# EAGLE board vdac (EAGLE 8.1.1)
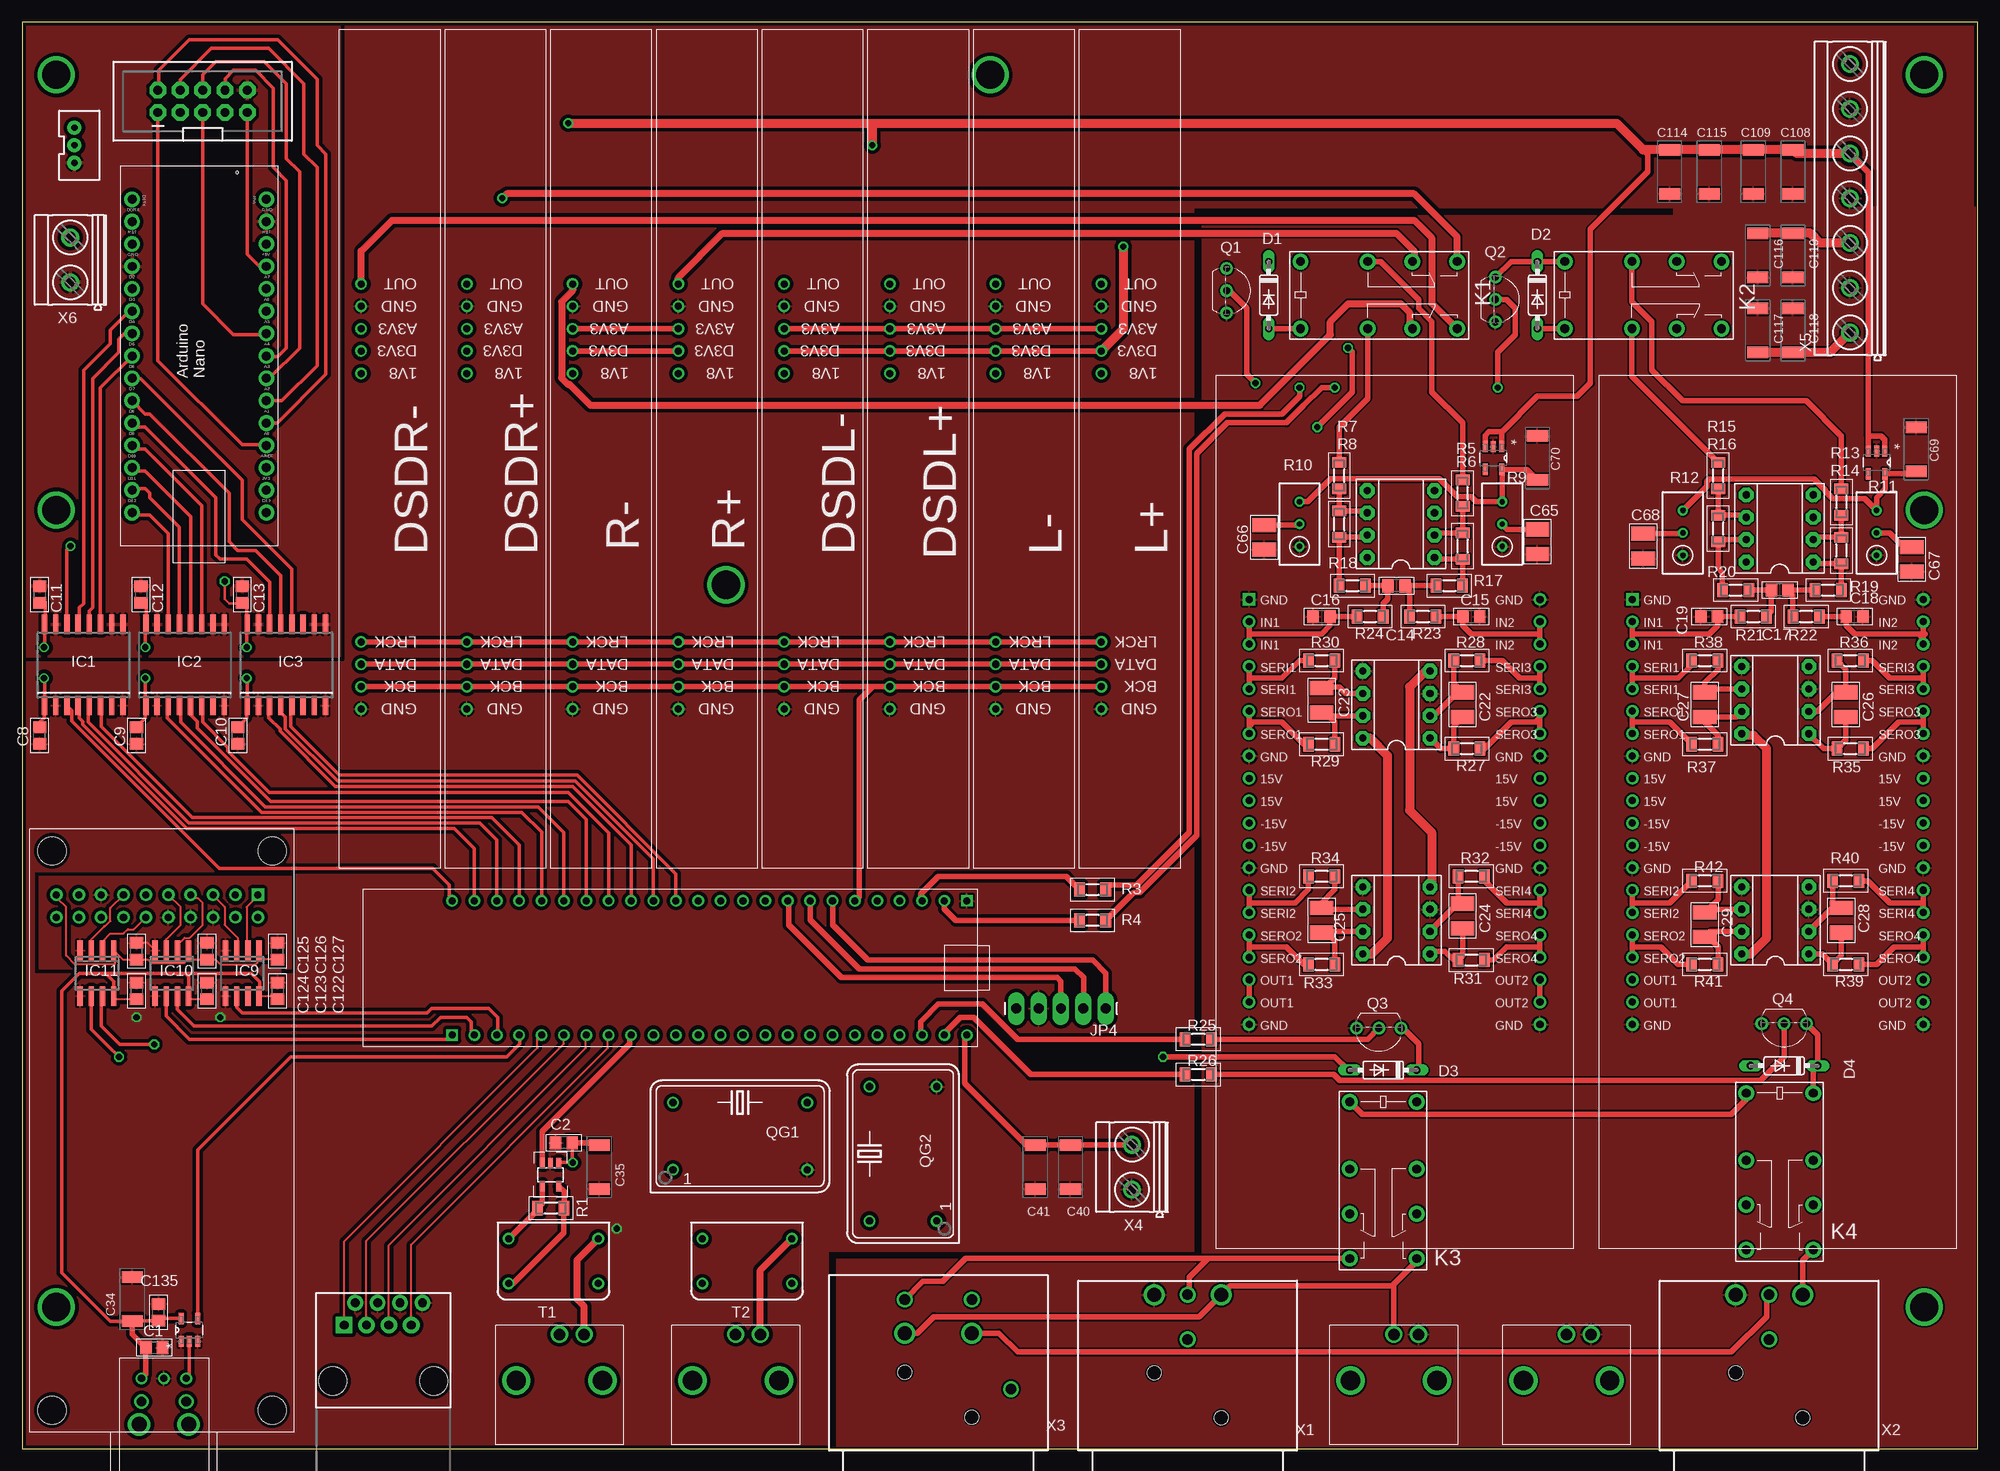
[diagram p6: board, top side]
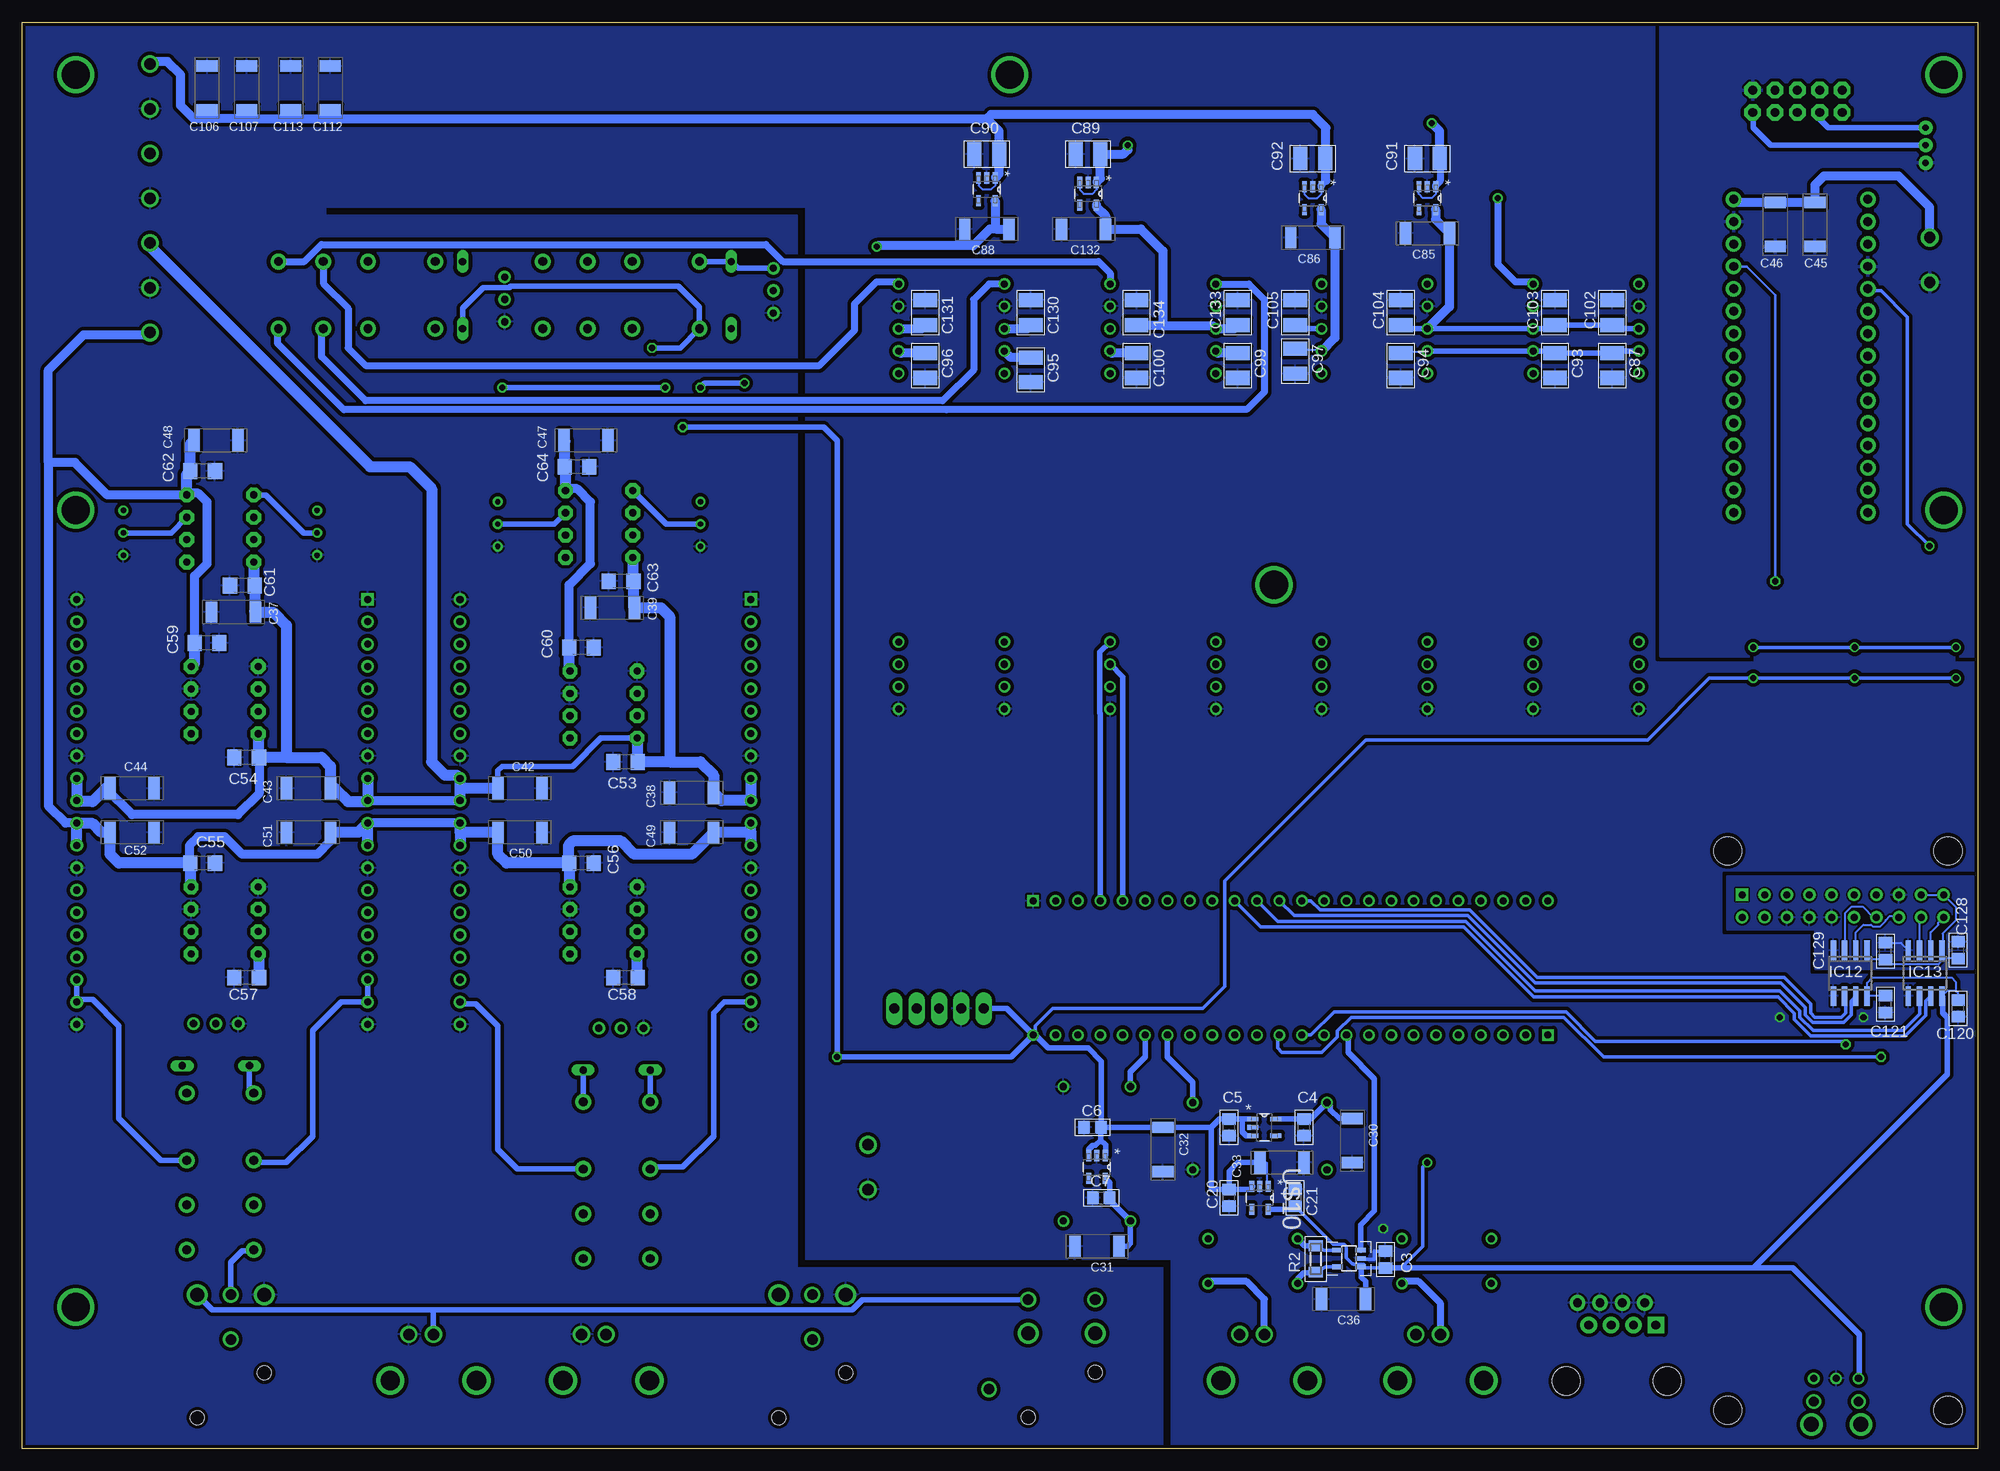
[diagram p7: board, bottom side, seen from below]

Size 222 x 162 mm. Coordinates in mm from the lower left corner, seen from the top.
Outline: 222,162 0,162 0,0 222,0 222,162
Copper layers (1*16): Top 0.035mm / dielectric 1.5mm / Bottom 0.035mm
Design rules "default *": minimum track width 10mil, minimum drill 24mil, track to track 8mil, track to pad 8mil, pad to pad 8mil, via to via 8mil, smd to smd 8mil, copper to edge 8mil, drill to drill 8mil, minimum pad ring 10mil, minimum via ring 8mil, stop-mask expansion 4mil, vias tented up to drill 0mil, thermal gap 10mil

## Footprints (pad centres in the part's own frame; a part is rotated, then mirrored left to right if it is on the bottom)
RCA = drill 1.3: 1_+ 0,0; 2_G -2.8,0 | drill 2.2: 3_NC -4.9,5.25; 4_NC 4.9,5.25
C0805 = smd 1.3 x 1.5: 1 -0.95,0; 2 0.95,0
C1210 = smd 1.6 x 2.7: 1 -1.4,0; 2 1.4,0
SP-CAP-CX = smd 1.3 x 2.4: + -2.5,0; - 2.5,0
C1206 = smd 1.6 x 1.8: 1 -1.4,0; 2 1.4,0
DO35-7 = drill 0.813 long: A 3.81,0; C -3.81,0
R2R = drill 0.8: 1 9.5,0; 2 12.04,0; 3 14.58,0; 4 17.12,0; 5 47.6,0; 6 50.14,0; 7 52.68,0; 8 55.22,0; 9 57.76,0
SO-16DW = smd 0.6 x 2.2: 1 -4.445,-4.6; 2 -3.175,-4.6; 3 -1.905,-4.6; 4 -0.635,-4.6; 5 0.635,-4.6; 6 1.905,-4.6; 7 3.175,-4.6; 8 4.445,-4.6; 9 4.445,4.6; 10 3.175,4.6; 11 1.905,4.6; 12 0.635,4.6; 13 -0.635,4.6; 14 -1.905,4.6; 15 -3.175,4.6; 16 -4.445,4.6
SO-08 = smd 0.6 x 2.2: 1 -1.905,-2.6; 2 -0.635,-2.6; 3 0.635,-2.6; 4 1.905,-2.6; 5 1.905,2.6; 6 0.635,2.6; 7 -0.635,2.6; 8 -1.905,2.6
RJ45-8 = drill 1 pad 1.88 square: 1 -4.445,6.35 | drill 1 pad 1.778: 2 -3.175,8.89; 4 -0.635,8.89; 6 1.905,8.89; 8 4.445,8.89 | drill 1 pad 1.88: 3 -1.905,6.35; 5 0.635,6.35; 7 3.175,6.35 | hole 3.2: -5.715,0; 5.715,0
2X5-SHROUDED = drill 1.016 pad 1.88 octagon: 1 -1.27,5.08; 2 1.27,5.08; 3 -1.27,2.54; 4 1.27,2.54; 5 -1.27,0; 6 1.27,0; 7 -1.27,-2.54; 8 1.27,-2.54; 9 -1.27,-5.08; 10 1.27,-5.08
JST-3-PTH-VERT = drill 0.7 pad 1.6: 1 -2,-0.55; 2 0,-0.55; 3 2,-0.55
1X05_LONGPADS = drill 1.118 pad 1.88 long: 1 0,0; 2 2.54,0; 3 5.08,0; 4 7.62,0; 5 10.16,0
G5V-2 = drill 1 pad 1.8: 1 -8.89,-3.81; 4 -1.27,-3.81; 6 3.81,-3.81; 8 8.89,-3.81; 9 8.89,3.81; 11 3.81,3.81; 13 -1.27,3.81; 16 -8.89,3.81
ARDUINO_NANO = drill 1.016 pad 1.778: 3V3 6.35,1.27; 5V 31.75,1.27; A0 11.43,1.27; A1 13.97,1.27; A2 16.51,1.27; A3 19.05,1.27; A4 21.59,1.27; A5 24.13,1.27; A6 26.67,1.27; A7 29.21,1.27; D2 29.21,16.51; D3 26.67,16.51; D4 24.13,16.51; D5 21.59,16.51; D6 19.05,16.51; D7 16.51,16.51; D8 13.97,16.51; D9 11.43,16.51; D10 8.89,16.51; D11 6.35,16.51; D12 3.81,16.51; D13 3.81,1.27; GND 31.75,16.51; GND. 36.83,1.27; REF 8.89,1.27; RST 34.29,16.51; RST. 34.29,1.27; RX1 36.83,16.51; TX1 39.37,16.51; VIN 39.37,1.27
TO92-EBC = drill 0.813 pad 1.422: B 0,-1.27; C -2.54,-1.27; E 2.54,-1.27
DIL14S = drill 0.813: 1 -7.62,-3.81; 7 7.62,-3.81; 8 7.62,3.81; 14 -7.62,3.81
MINI_MELF-0204W = smd 1.2 x 1.6: 1 -1.5,0; 2 1.5,0
RTRIM3296W = drill 0.61: 1 0,-2.54; 2 0,0; 3 0,2.54
DAC101 = drill 0.8 pad 1.27: 1 -5.08,2.54; 3 -5.08,-2.54; 4 5.08,-2.54; 6 5.08,2.54
SOT95P280X145-5N = smd 1.27 x 0.559: 1 -1.295,0.94; 2 -1.295,0; 3 -1.295,-0.94; 4 1.295,-0.94; 5 1.295,0.94
COMBO384 = drill 0.8 pad 1.422 square: 1_CABLE_PLUGGED 23.36,61 | drill 0.8 pad 1.422: 2_SDA 20.82,61; 3_DATA/DSD1 18.28,61; 4_CLD/DSDCLK 15.74,61; 5_FSCLK/DSD2 13.2,61; 6_MCLK 10.66,61; 7_DSDON 8.12,61; 8_GND 5.58,61; 9_3.3V 3.04,61; 10_3.3V 0.5,61; 11_MUTE 23.36,58.46; 12_SDA 20.82,58.46; 13_GND 18.28,58.46; 14_GND 15.74,58.46; 15_GND 13.2,58.46; 16_DSD64_128 10.66,58.46; 17_F0 8.12,58.46; 18_F1 5.58,58.46; 19_F2 3.04,58.46; 20_F3 0.5,58.46 | hole 3.2: 25,2.5; 0,2.5; 25,66; 0,66
TORX147 = drill 0.8: 1_VOUT -2.54,0; 2_GND 0,0; 3_VCC 2.54,0 | drill 1.1: 4_NC -2.54,2.625; 5_NC 2.54,2.625 | drill 1.7: P$1 -2.8,5.235; P$2 2.8,5.235
SOT23-5L = smd 0.55 x 1.2: 1 -0.95,-1.3; 2 0,-1.3; 3 0.95,-1.3; 4 0.95,1.3; 5 -0.95,1.3
DIL08 = drill 0.813 pad 1.676 octagon: 1 -3.81,-3.81; 2 -1.27,-3.81; 3 1.27,-3.81; 4 3.81,-3.81; 5 3.81,3.81; 6 1.27,3.81; 7 -1.27,3.81; 8 -3.81,3.81
SOT-23-5 = smd 1.27 x 0.559: 1 -1.295,0.94; 2 -1.295,0; 3 -1.295,-0.94; 4 1.295,-0.94; 5 1.295,0.94
VDACA = drill 0.8 pad 1.422 square: P$1 1.27,-19.05 | drill 0.8 pad 1.422: P$2 1.27,-21.59; P$3 1.27,-24.13; P$4 1.27,-26.67; P$5 1.27,-29.21; P$6 1.27,-31.75; P$7 1.27,-34.29; P$8 1.27,-36.83; P$9 1.27,-39.37; P$10 1.27,-41.91; P$11 1.27,-44.45; P$12 1.27,-46.99; P$13 1.27,-49.53; P$14 1.27,-52.07; P$15 1.27,-54.61; P$16 1.27,-57.15; P$17 1.27,-59.69; P$18 1.27,-62.23; P$19 1.27,-64.77; P$20 1.27,-67.31; P$21 34.29,-67.31; P$22 34.29,-64.77; P$23 34.29,-62.23; P$24 34.29,-59.69; P$25 34.29,-57.15; P$26 34.29,-54.61; P$27 34.29,-52.07; P$28 34.29,-49.53; P$29 34.29,-46.99; P$30 34.29,-44.45; P$31 34.29,-41.91; P$32 34.29,-39.37; P$33 34.29,-36.83; P$34 34.29,-34.29; P$35 34.29,-31.75; P$36 34.29,-29.21; P$37 34.29,-26.67; P$38 34.29,-24.13; P$39 34.29,-21.59; P$40 34.29,-19.05
CMODA7 = drill 0.8 square: P$1 59.69,16.51; P$25 1.27,1.27 | drill 0.8: P$2 57.15,16.51; P$3 54.61,16.51; P$4 52.07,16.51; P$5 49.53,16.51; P$6 46.99,16.51; P$7 44.45,16.51; P$8 41.91,16.51; P$9 39.37,16.51; P$10 36.83,16.51; P$11 34.29,16.51; P$12 31.75,16.51; P$13 29.21,16.51; P$14 26.67,16.51; P$15 24.13,16.51; P$16 21.59,16.51; P$17 19.05,16.51; P$18 16.51,16.51; P$19 13.97,16.51; P$20 11.43,16.51; P$21 8.89,16.51; P$22 6.35,16.51; P$23 3.81,16.51; P$24 1.27,16.51; P$26 3.81,1.27; P$27 6.35,1.27; P$28 8.89,1.27; P$29 11.43,1.27; P$30 13.97,1.27; P$31 16.51,1.27; P$32 19.05,1.27; P$33 21.59,1.27; P$34 24.13,1.27; P$35 26.67,1.27; P$36 29.21,1.27; P$37 31.75,1.27; P$38 34.29,1.27; P$39 36.83,1.27; P$40 39.37,1.27; P$41 41.91,1.27; P$42 44.45,1.27; P$43 46.99,1.27; P$44 49.53,1.27; P$45 52.07,1.27; P$46 54.61,1.27; P$47 57.15,1.27; P$48 59.69,1.27
NC3MBH = drill 1.6: 1 3.81,0; 2 -3.81,0 | drill 1.2: 3 0,0; G 0,5.08 | hole 1.6: -3.81,13.97; 3.81,8.89
NC4FBH = drill 1.2: 1 -3.81,0.55; 4 3.81,0.55; G -8.25,10.72 | drill 1.6: 2 -3.81,4.365; 3 3.81,4.365 | hole 1.6: -3.81,13.89; 3.81,8.81
MKDSN1,5/2-5,08 = drill 1.3 pad 2: 1 -2.561,0.025; 2 2.519,0.025
MKDSN1,5/7-5,08 = drill 1.3 pad 2: 1 -15.261,0.025; 2 -10.181,0.025; 3 -5.101,0.025; 4 -0.021,0.025; 5 5.059,0.025; 6 10.139,0.025; 7 15.219,0.025

## Placement (x,y rotation side)
BNC  RCA  [RCA]  81,13 180 top
C1  [C0805]  15,11.5 0 top
C2  [C0805]  61.5,34.75 180 top
C3  [C0805]  67.25,21.5 90 bottom
C4  [C0805]  76.5,36.5 90 bottom
C5  [C0805]  85,36.5 90 bottom
C6  [C0805]  100.5,36.5 0 bottom
C7  [C0805]  99.5,28.5 0 bottom
C8  [C0805]  2,81 90 top
C9  [C0805]  13,81 90 top
C10  [C0805]  24.5,81 90 top
C11  [C0805]  2,97 270 top
C12  [C0805]  13.5,97 270 top
C13  [C0805]  25,97 270 top
C14  [C0805]  156,98 180 top
C15  [C0805]  164.5,94.5 0 top
C16  [C0805]  147.5,94.5 0 top
C17  [C0805]  199.5,97.5 180 top
C18  [C0805]  208,94.5 0 top
C19  [C0805]  191.5,94.5 0 top
C20  [C0805]  85,28.5 90 bottom
C21  [C0805]  77.5,28.5 270 bottom
C22  [C1210]  163.5,84.5 270 top
C23  [C1210]  147.5,85 270 top
C24  [C1210]  163.5,60.5 270 top
C25  [C1210]  147.5,60 270 top
C26  [C1210]  207,84.5 270 top
C27  [C1210]  191,84.5 270 top
C28  [C1210]  206.5,60 270 top
C29  [C1210]  191,59.5 270 top
C30  [SP-CAP-CX]  71,35 270 bottom
C31  [SP-CAP-CX]  100,23 180 bottom
C32  [SP-CAP-CX]  92.5,34 270 bottom
C33  [SP-CAP-CX]  79,32.5 0 bottom
C34  [SP-CAP-CX]  12.5,17 90 top
C35  [SP-CAP-CX]  65.5,32 270 top
C36  [SP-CAP-CX]  72,17 180 bottom
C37  [SP-CAP-CX]  198,95 180 bottom
C38  [SP-CAP-CX]  146,74.5 180 bottom
C39  [SP-CAP-CX]  155,95.5 180 bottom
C40  [SP-CAP-CX]  119,32 270 top
C41  [SP-CAP-CX]  115,32 270 top
C42  [SP-CAP-CX]  165.5,75 0 bottom
C43  [SP-CAP-CX]  189.5,75 180 bottom
C44  [SP-CAP-CX]  209.5,75 0 bottom
C45  [SP-CAP-CX]  18.5,139 270 bottom
C46  [SP-CAP-CX]  23,139 270 bottom
C47  [SP-CAP-CX]  158,114.5 180 bottom
C48  [SP-CAP-CX]  200,114.5 180 bottom
C49  [SP-CAP-CX]  146,70 0 bottom
C50  [SP-CAP-CX]  165.5,70 180 bottom
C51  [SP-CAP-CX]  189.5,70 0 bottom
C52  [SP-CAP-CX]  209.5,70 180 bottom
C53  [C1206]  153.5,78 180 bottom
C54  [C1206]  196.5,78.5 180 bottom
C55  [C1206]  201.5,66.5 180 bottom
C56  [C1206]  158.5,66.5 180 bottom
C57  [C1206]  196.5,53.5 180 bottom
C58  [C1206]  153.5,53.5 180 bottom
C59  [C1206]  201,91.5 180 bottom
C60  [C1206]  158.5,91 180 bottom
C61  [C1206]  197,98 180 bottom
C62  [C1206]  201.5,111 180 bottom
C63  [C1206]  154,98.5 180 bottom
C64  [C1206]  159,111.5 180 bottom
C65  [C1210]  172,103 270 top
C66  [C1210]  141,103.5 270 top
C67  [C1210]  214.5,101 270 top
C68  [C1210]  184,102.5 270 top
C69  [SP-CAP-CX]  215,113.5 90 top
C70  [SP-CAP-CX]  172,112.5 90 top
C85  [SP-CAP-CX]  62.5,138 180 bottom
C86  [SP-CAP-CX]  75.5,137.5 180 bottom
C87  [C1210]  41.5,123 270 bottom
C88  [SP-CAP-CX]  112.5,138.5 180 bottom
C89  [C1210]  101,147 180 bottom
C90  [C1210]  112.5,147 180 bottom
C91  [C1210]  62.5,146.5 180 bottom
C92  [C1210]  75.5,146.5 180 bottom
C93  [C1210]  48,123 270 bottom
C94  [C1210]  65.5,123 270 bottom
C95  [C1210]  107.5,122.5 270 bottom
C96  [C1210]  119.5,123 270 bottom
C97  [C1210]  77.5,123.5 270 bottom
C99  [C1210]  84,123 270 bottom
C100  [C1210]  95.5,123 270 bottom
C102  [C1210]  41.5,129 90 bottom
C103  [C1210]  48,129 90 bottom
C104  [C1210]  65.5,129 90 bottom
C105  [C1210]  77.5,129 90 bottom
C106  [SP-CAP-CX]  201,154.5 90 bottom
C107  [SP-CAP-CX]  196.5,154.5 90 bottom
C108  [SP-CAP-CX]  201,145 270 top
C109  [SP-CAP-CX]  196.5,145 270 top
C112  [SP-CAP-CX]  187,154.5 90 bottom
C113  [SP-CAP-CX]  191.5,154.5 90 bottom
C114  [SP-CAP-CX]  187,145 270 top
C115  [SP-CAP-CX]  191.5,145 270 top
C116  [SP-CAP-CX]  197,135.5 270 top
C117  [SP-CAP-CX]  197,127 270 top
C118  [SP-CAP-CX]  201,127 270 top
C119  [SP-CAP-CX]  201,135.5 270 top
C120  [C0805]  2.25,50 90 bottom
C121  [C0805]  10.5,50.5 90 bottom
C122  [C0805]  29,52 270 top
C123  [C0805]  21,52 270 top
C124  [C0805]  13,52 270 top
C125  [C0805]  13,56.5 90 top
C126  [C0805]  21,56.5 90 top
C127  [C0805]  29,56.5 90 top
C128  [C0805]  2.25,56.62 90 bottom
C129  [C0805]  10.5,56.5 90 bottom
C130  [C1210]  107.5,129 90 bottom
C131  [C1210]  119.5,129 90 bottom
C132  [SP-CAP-CX]  101.5,138.5 180 bottom
C133  [C1210]  84,129 90 bottom
C134  [C1210]  95.5,129 90 bottom
C135  [C0805]  15.5,15.5 90 top
COAX  RCA  [RCA]  61,13 180 top
D1  1N4148DO35-7  [DO35-7]  141.5,131 270 top
D2  1N4148DO35-7  [DO35-7]  172,131 270 top
D3  1N4148DO35-7  [DO35-7]  154.5,43 180 top
D4  1N4148DO35-7  [DO35-7]  200,43.5 180 top
DSDL+  R2R  [R2R]  98.5,74.5 90 top
DSDL-  R2R  [R2R]  86.5,74.5 90 top
DSDR+  R2R  [R2R]  50.5,74.5 90 top
DSDR-  R2R  [R2R]  38.5,74.5 90 top
IC1  ISO7240  [SO-16DW]  7,89 0 top
IC2  ISO7240  [SO-16DW]  18.5,89 0 top
IC3  ISO7240  [SO-16DW]  30,89 0 top
IC9  ISO7220A  [SO-08]  25,54 180 top
IC10  ISO7220A  [SO-08]  17,54 180 top
IC11  ISO7220A  [SO-08]  8.5,54 180 top
IC12  ISO7220A  [SO-08]  14.5,54 180 bottom
IC13  ISO7220A  [SO-08]  6,54 180 bottom
JP1  RJ45  [RJ45-8]  41,7.7 0 top
JP2  [2X5-SHROUDED]  20.5,153 90 top
JP3  [JST-3-PTH-VERT]  6.5,148 270 top
JP4  [1X05_LONGPADS]  123,50 180 top
K1  G5V-2  [G5V-2]  154,131 0 top
K2  G5V-2  [G5V-2]  184,131 0 top
K3  G5V-2  [G5V-2]  154.5,30.5 270 top
K4  G5V-2  [G5V-2]  199.5,31.5 270 top
L+  R2R  [R2R]  122.5,74.5 90 top
L-  R2R  [R2R]  110.5,74.5 90 top
PCB1  ARDUINO_NANO  [ARDUINO_NANO]  29,102.5 90 top
Q1  BC550C  [TO92-EBC]  138,131.5 270 top
Q2  BC550C  [TO92-EBC]  168.5,130.5 270 top
Q3  BC550C  [TO92-EBC]  154,46.5 180 top
Q4  BC550C  [TO92-EBC]  200,47 180 top
QG1  [DIL14S]  81.5,35.5 0 top
QG2  [DIL14S]  100,33.5 90 top
R1  [MINI_MELF-0204W]  60.03,27.34 0 top
R2  [MINI_MELF-0204W]  75.16,21.55 270 bottom
R3  [MINI_MELF-0204W]  121.5,63.5 0 top
R4  [MINI_MELF-0204W]  121.5,60 0 top
R5  [MINI_MELF-0204W]  163.5,108.5 270 top
R6  [MINI_MELF-0204W]  163.5,102.5 270 top
R7  [MINI_MELF-0204W]  149.5,110.5 270 top
R8  [MINI_MELF-0204W]  149.5,105 270 top
R9  [RTRIM3296W]  168,105 0 top
R10  [RTRIM3296W]  145,105 0 top
R11  [RTRIM3296W]  210.5,104 0 top
R12  [RTRIM3296W]  188.5,104 0 top
R13  [MINI_MELF-0204W]  206.5,107.5 270 top
R14  [MINI_MELF-0204W]  206.5,102 270 top
R15  [MINI_MELF-0204W]  192.5,110.5 270 top
R16  [MINI_MELF-0204W]  192.5,104.5 270 top
R17  [MINI_MELF-0204W]  162,98 180 top
R18  [MINI_MELF-0204W]  151,98 0 top
R19  [MINI_MELF-0204W]  205,97.5 180 top
R20  [MINI_MELF-0204W]  194.5,97.5 0 top
R21  [MINI_MELF-0204W]  196.5,94.5 180 top
R22  [MINI_MELF-0204W]  202.5,94.5 0 top
R23  [MINI_MELF-0204W]  159,94.5 0 top
R24  [MINI_MELF-0204W]  153,94.5 180 top
R25  [MINI_MELF-0204W]  133.5,46.5 0 top
R26  [MINI_MELF-0204W]  133.5,42.5 0 top
R27  [MINI_MELF-0204W]  164,79.5 0 top
R28  [MINI_MELF-0204W]  164,89.5 180 top
R29  [MINI_MELF-0204W]  147.5,80 180 top
R30  [MINI_MELF-0204W]  147.5,89.5 0 top
R31  [MINI_MELF-0204W]  164.5,55.5 0 top
R32  [MINI_MELF-0204W]  164.5,65 180 top
R33  [MINI_MELF-0204W]  147.5,55 180 top
R34  [MINI_MELF-0204W]  147.5,65 0 top
R35  [MINI_MELF-0204W]  207.5,79.5 0 top
R36  [MINI_MELF-0204W]  207.5,89.5 180 top
R37  [MINI_MELF-0204W]  191,80 180 top
R38  [MINI_MELF-0204W]  191,89.5 0 top
R39  [MINI_MELF-0204W]  207,55 0 top
R40  [MINI_MELF-0204W]  207,64.5 180 top
R41  [MINI_MELF-0204W]  191,55 180 top
R42  [MINI_MELF-0204W]  191,64.5 0 top
R+  R2R  [R2R]  74.5,74.5 90 top
R-  R2R  [R2R]  62.5,74.5 90 top
RCAL  RCA  [RCA]  175.3,13 180 top
RCAR  RCA  [RCA]  155.7,13 180 top
T1  DAC101C  [DAC101]  60.32,21.31 180 top
T2  DAC101C  [DAC101]  82.29,21.31 180 top
U1  SN74LVC1G125DBVT  [SOT95P280X145-5N]  19,13.5 90 top
U$1  COMBO384  [COMBO384]  3.4,1.9 0 top
U$2  TORX147  [TORX147]  16.1,8 180 top
U$3  MAX3280E  [SOT23-5L]  59.98,31.12 180 top
U$4  MAX3280E  [SOT23-5L]  71.38,21.61 90 bottom
U$5  LME49720  [DIL08]  156.5,105 90 top
U$6  LME49720  [DIL08]  199.5,104.5 90 top
U$7  LP5907  [SOT-23-5]  167,112.5 270 top
U$8  LP5907  [SOT-23-5]  210.5,112 270 top
U$9  VDACA  [VDACA]  181.5,115.5 0 top
U$10  LP5907  [SOT-23-5]  81.5,28.5 270 bottom
U$11  VDACA  [VDACA]  138,115.5 0 top
U$12  CMOD-A7  [CMODA7]  108.5,63.5 180 top
U$13  LME49720  [DIL08]  156,84.5 90 top
U$14  LME49720  [DIL08]  156,60 90 top
U$15  LP5907  [SOT-23-5]  81,36.5 0 bottom
U$16  LP5907  [SOT-23-5]  100,32 270 bottom
U$17  LP5907  [SOT-23-5]  75.5,142 270 bottom
U$18  LP5907  [SOT-23-5]  62.5,142 270 bottom
U$19  LP5907  [SOT-23-5]  101,142.5 270 bottom
U$20  LP5907  [SOT-23-5]  112.5,143 270 bottom
U$21  LME49720  [DIL08]  199,85 90 top
U$22  LME49720  [DIL08]  199,60 90 top
X1  NC3MBH  [NC3MBH]  132.3,17.5 180 top
X2  NC3MBH  [NC3MBH]  198.3,17.5 180 top
X3  NC4FBH  [NC4FBH]  104,17.5 180 top
X4  MKDSN1,5/2-5,08  [MKDSN1,5/2-5,08]  126,32 90 top
X5  MKDSN1,5/7-5,08  [MKDSN1,5/7-5,08]  207.5,142 90 top
X6  MKDSN1,5/2-5,08  [MKDSN1,5/2-5,08]  5.5,135 90 top

## Tracks (layer width: path | path; a pad name or v marks a point on that pad's centre or on a via)
22.5792
  Bottom 0.61: QG2.8 96.19,42.81 94.5,44.5 94.5,46.96 U$12.P$19
24.756
  Bottom 0.61: QG1.8 89.12,41.62 92,44.5 U$12.P$18
+15V
  Top 1.016: U$14.8 153.19,56.19 155,58 155,78.69 153,80.69 U$13.8 | U$22.8 196.19,56.19 198,58 198,79.5 196.5,81 195.38,81 U$21.8 | X5.3 204.1,136.9 203,138 C119.+ C116.+
  Bottom 0.61: U$13.8 156.31,80.69 159.5,77.5 167.5,77.5 168,77 C42.+
  Bottom 1.016: C54.1 195.1,74.4 197.5,72 209.5,72 212.5,75 | U$9.P$10 U$11.P$31
  Bottom 1.27: X5.3 207.47,136.47 182.5,111.5 178,111.5 175.5,109 175.5,78 174,76.5 172.66,76.5 U$11.P$32 172.29,75 | U$11.P$31 172.29,75 | C42.+ 172.29,75 | U$11.P$9 U$11.P$10 142.59,73.59 C38.+ 143.5,76.5 145,78 148.5,78 | 148.5,78 C53.1 152.1,80.6 U$13.8 | U$5.8 152.69,98.59 C63.1 152.6,95.6 C39.+ 149.5,95.5 148.5,94.5 148.5,78 | U$6.8 195.69,98.09 C61.1 195.6,95.1 C37.+ 193.5,95 192,93.5 192,78.5 | U$21.8 195.19,78.59 C54.1 192,78.5 | C44.+ 212.5,75 214,73.5 215.7,73.5 U$9.P$31 U$9.P$32 | U$9.P$9 U$9.P$10 182.86,73.5 185,73.5 186.5,75 C43.+ 187,77.5 188,78.5 192,78.5 | C57.1 195.1,56.1 U$22.8 | U$14.8 152.19,53.59 C58.1
-15V
  Top 1.016: C117.- C118.- 205.24,124.5 X5.1 | U$13.4 159.31,88.31 157.5,86.5 157.5,72.5 160,70 160,64 U$14.4
  Bottom 1.016: U$11.P$30 U$9.P$11 | C51.- 187,69 188.5,67.5 197,67.5 199,69.5 202,69.5 203,68.5 203,66.6 C55.2 | U$9.P$30 217.05,71.05 219,73 219,112 | 219,112 219,122.5 215,126.5 207.71,126.5 X5.1 | 219,112 216,112 212.31,108.31 U$6.4 203.12,108.5 202,108.5 201,107.5 201,100.5 202.4,99.1 C59.2 | C60.2 159.9,98.1 157.5,100.5 157.5,107.5 159,109 160.12,109 U$5.4
  Bottom 1.27: U$5.4 160.31,111.41 C64.2 160.4,114.4 C47.- | U$6.4 203.31,110.59 C62.2 202.9,114.1 C48.- | C59.2 202.4,89.22 U$21.4 | U$22.4 202.9,63.9 C55.2 211,66.5 212,67.5 C52.- 213,70 214,71 215.74,71 U$9.P$30 U$9.P$29 | C51.- 183.82,70 U$9.P$11 U$9.P$12 | 172.29,70 U$11.P$30 | 172.29,70 U$11.P$29 | 172.29,70 C50.- 168,67.5 167,66.5 C56.2 | 139.27,70 U$11.P$11 | 139.27,70 U$11.P$12 | 139.27,70 C49.- 146,67.5 152.5,67.5 154,69 159.5,69 160,68.5 160,66.6 C56.2 | C56.2 159.9,63.9 U$14.4 | C60.2 159.9,88.4 U$13.4
A
  Top 0.406: JP2.1 15.42,123.58 25,114 27.66,114 PCB1.A0
B
  Top 0.406: PCB1.A1 28.97,116.47 34.5,122 34.5,147 33.5,148 33.5,155.5 29,160 19,160 15.5,156.5 15.5,154.35 JP2.2
BCK
  Top 0.61: DSDR-.2 DSDR+.2 R-.2 R+.2 DSDL-.2 DSDL+.2 | DSDL+.2 L-.2 L+.2 | DSDL+.2 96.54,86.54 95,85 95,62.7 U$12.P$30
BCKI
  Top 0.61: JP4.3 117.92,53.08 117.5,53.5 93,53.5 87,59.5 87,62.14 U$12.P$33
BNCIN
  Bottom 0.61: U$4.3 70.08,25.42 68.5,27 68.5,42 71.5,45 71.5,46.82 U$12.P$10
COAXIN
  Top 0.61: U$3.3 59.03,36.03 69,46 69,46.86 U$12.P$9
D2  (via drill 0.7)
  Top 0.406: IC1.14 5.09,102.09 v5.5,102.5
  Bottom 0.406: v5.5,102.5 8,105 8,128.5 11,131.5 12.28,131.5 PCB1.D2
D3
  Top 0.406: PCB1.D3 12.17,129.17 10,127 10,125.5 7,122.5 7,96 6.5,95.5 6.5,93.73 IC1.13
D4
  Top 0.406: IC1.12 7.63,95.14 8,95.5 8,121.5 11,124.5 11,126 12,127 12.12,127 PCB1.D4
D5
  Top 0.406: IC1.11 8.9,120.5 PCB1.D5
DACA  (via drill 0.7)
  Top 0.61: 167.94,115.44 U$7.1 | 167.94,115.44 172,119.5 176.5,119.5 178,121 178,138.5 184.5,145 184.5,147 184,147.5 | 209.56,115 U$8.3 | 209.56,115 209.56,144.97 X5.5 | U$8.1 211.44,114.56 211,115 209.56,115 | U$7.3 166.06,115.06 166.5,115.5 167.88,115.5 167.94,115.44
  Top 1.016: v62,150.5 96.5,150.5 | 96.5,150.5 179.5,150.5 180,150.5 180.5,150.5 181,150.5 184,147.5 C114.+ C115.+ C109.+ C108.+ 201.44,147.06 X5.5 | 96.5,150.5 v96.5,148
  Bottom 0.254: 100.01,143.85 100.25,143.75 U$19.1 100,143.74 100,143 100.5,142.5 101.5,142.5 101.94,142.94 U$19.3 | U$18.1 61.56,142.44 62,142 63,142 63.5,142.5 63.5,143.24 U$18.3
  Bottom 0.813: U$18.1 61.56,143.44 61,144 61,146.4 C91.1
  Bottom 1.016: 100.01,143.85 99.6,144.26 C89.1 97,147 96.5,147.5 v96.5,148 | C91.1 61.1,149.6 v62,150.5
DACD
  Bottom 0.254: 111.51,144.35 111.75,144.25 U$20.1 111.5,144.24 111.5,143.5 112,143 113,143 113.44,143.44 U$20.3 | U$17.3 76.44,142.44 76,142 75,142 74.5,142.5 74.5,143.24 U$17.1
  Bottom 0.813: U$17.1 74.56,143.44 74,144 74,146.4 C92.1
  Bottom 1.016: 111.51,144.35 111.1,144.76 C90.1 111.1,149.6 112.5,151 | 187,151 112.5,151 | 191.5,151 187,151 | 196.5,151 191.5,151 | 196.5,151 201.26,151 | 74,144 74,150 75.5,151.5 112,151.5 112.5,151 | C112.+ 187,151 | C113.+ 191.5,151 | C107.+ 196.5,151 | C106.+ 201,151.26 201.26,151 | 201.26,151 202.5,151 204,152.5 204,156 205.5,157.5 207.19,157.5 X5.7
DATA
  Top 0.61: L+.3 L-.3 DSDL+.3 DSDL-.3 R+.3 R-.3 DSDR+.3 DSDR-.3
  Bottom 0.61: U$12.P$29 97.07,87.65 DSDL+.3
DATAI
  Top 0.61: U$12.P$32 89.45,60.05 95,54.5 119.5,54.5 120.5,53.5 120.5,50.04 JP4.2
DSD  (via drill 0.7)
  Top 0.406: v15,45.93 11.07,45.93 9,48 9,51.27 IC11.7
  Bottom 0.406: U$12.P$12 75.71,46.99 73.09,49.61 46.75,49.61 43.42,46.28 15.28,46.28 15,46 v15,45.93
F0
  Bottom 0.406: U$12.P$37 75.71,62.23 74.65,61.17 57.67,61.17 50,53.5 22,53.5 19,50.5 19,49.5 18.5,49 15.5,49 15,49.5 15,51.27 IC12.6
F1
  Bottom 0.406: IC12.7 14.39,50.88 14.39,49.25 15.25,48.39 18.75,48.39 19.61,49.25 19.61,50.11 22.39,52.89 50.25,52.89 57.92,60.56 77.62,60.56 U$12.P$36
F2
  Bottom 0.406: IC13.6 6.63,49.37 8.5,47.5 18.72,47.5 20.22,48.99 20.22,49.72 22.5,52 50.22,52 58.11,59.89 79.49,59.89 U$12.P$35
F3
  Bottom 0.406: IC13.7 5.93,50.84 5.93,49.21 8.25,46.89 18.98,46.89 20.83,48.74 20.83,49.47 22.68,51.32 50.41,51.32 58.37,59.28 81.42,59.28 U$12.P$34
FDSDON1
  Top 0.61: R3.1 118.5,65 104,65 102,63 102,62.38 U$12.P$27
FDSDON2
  Top 0.61: U$12.P$26 104.69,61.31 106,60 R4.1
FV  (via drill 0.7)
  Top 0.406: C8.2 2,82.5 2.5,83 2.5,84.34 IC1.1 2.56,86.94 2.5,87 v2.5,87.5 | C9.2 13,82 14,83 14,84.34 IC2.1 14,84.45 v14,87.5 | C10.2 24.5,82 25.5,83 25.5,84.34 IC3.1 25.55,87.44 v25.5,87.5
  Top 0.61: K2.1 D2.A | D1.A K1.1 | K4.1 195.69,39.69 194,38 158.91,38 158.89,37.98 152.1,37.98 K3.1 | D3.A 150.5,43 149,44.5 v129.5,44.5 | v147,116 151,120 151,124.5 v150.5,125 | X4.2 119.02,34.52 C40.+ C41.+ 114,34.5 107,41.5 107,46.76 U$12.P$24
  Bottom 0.254: C33.+ 80.75,32.5 80.75,30 U$10.1
  Bottom 0.406: v2.5,87.5 v14,87.5 v25.5,87.5 30.5,87.5 37.5,80.5 69.5,80.5 85.5,64.5 85.5,52.5 88,50 105,50 107,48 107,47.22 U$12.P$24 106.99,46.99
  Bottom 0.61: 106.99,46.99 105.5,45.5 101,45.5 99.5,44 99.5,36.55 C6.2 | 87,36.5 C32.+ C6.2 | 99.55,35.05 C6.2 | 99.55,35.05 99,34.5 99,33.36 U$16.1 | C20.2 82.44,29.45 U$10.3 82.3,29.8 | C20.2 87,29.45 87,36.5 | 99.55,35.05 100.16,34.44 100.49,34.44 100.94,33.99 U$16.3 | C33.+ 84,32.5 85,31.5 C20.2 | D2.A 172,129.5 169.68,131.82 166.72,131.82 166.55,132 147.5,132 145.11,129.61 K1.1 147.3,125 v150.5,125 | D3.A K3.1 | D4.A 196.19,40.89 K4.1 | 83.5,37.45 C5.2 86.05,37.45 87,36.5 | 83.5,37.45 U$15.1 | U$15.3 83.06,35.56 83.5,36 83.5,37.45 | v147,116 131,116 129.5,114.5 v129.5,44.5 109.72,44.5 U$12.P$24 110.24,50 JP4.5
GND  (via drill 0.7)
  Bottom 0.406: C3.2 68.45,22.45 68.5,22.5 68.5,21.5 69.41,21.5 69.45,21.54 69.63,21.54 69.8,21.59 69.92,21.54 70.01,21.54 U$4.2
  other vias: 13,49 22.5,49 67.5,25
  pour Bottom (isolate 0.406, rank 2): -0.5,-0.5 91.5,-0.5 91.5,21.5 133,21.5 133,141 222,141 222,162 -0.5,162
  pour Top (isolate 0.406, rank 2): -0.5,-0.5 91.5,-0.5 91.5,22.5 133,22.5 133,141 222,141 222,162 -0.5,162
  pour Top: 92.5,-1 92.5,21.5 134,21.5 134,140 187.5,140 187.5,141 222.5,141 222.5,-1
  pour Bottom (isolate 0.406): 92.5,-0.5 92.5,20.5 134,20.5 134,140 187.5,140 187.5,141 222.5,141 222.5,-0.5
I3V3  (via drill 0.7)
  Top 0.254: C124.2 10.76,51.05 IC11.8 | C122.2 28.65,51.4 IC9.8 27,51.49 | 4.5,52 4.5,22.5 | 9.5,54 18.5,54 26,54 | C123.2 19.25,51.05 IC10.8
  Top 0.406: 62,32.5 v62.5,32.5 | 62,32.5 61.01,32.5 U$3.1 | C2.1 62.45,32.95 62,32.5 | U1.5 15.5,14.79 C135.1 12.5,14.55 C34.+ 10,14.5 4.5,20 4.5,52 6.5,54 9.5,54 | 9.5,54 12.07,54 12.08,54.01 25.99,54.01 26,54 27,53 27,51.49 | IC10.8 18.91,53.59 18.5,54 | IC11.8 10.4,53.09 9.5,54
  Top 0.61: C2.1 65.25,34.75 C35.+ | U$2.3_VCC 14.05,8.49 C1.1 14,11.5 12.5,13 C34.+
  Bottom 0.254: C120.2 2.25,51.75 2.5,52 | 2.5,52 3.5,52 IC13.8 | C121.2 12.54,51.45 IC12.8 12.6,52.91 12,53.5 3,53.5 2.5,53 2.5,52
  Bottom 0.406: C21.2 73.19,23.24 71.91,23.24 71.67,23 71.67,21.67 71,21 70.92,21 70.85,20.93 70.35,20.93 U$4.1 69.97,20.55 C3.1 65.45,20.55 63,23 63,32 v62.5,32.5
  Bottom 0.61: U$10.5 77.5,27.2 C21.2 | 70.39,20.83 69.75,20.83 U$4.1 70,20.58 70,19.5 69.5,19 C36.+ | C3.1 25.45,20.55 | 25.45,20.55 3.5,42.5 3.5,48.18 3.51,48.19 3.51,49.01 4,49.5 4,51.3 IC13.8 | 25.45,20.55 21.05,20.55 13.5,13 13.5,8.06 U$2.3_VCC
K
  Top 0.406: JP2.4 17.96,155.46 21.5,159 28,159 32,155 32,147 33.5,145.5 33.5,123 29.5,119 PCB1.A2
L+
  Top 0.61: K2.13 182.73,130.27 185,128 185,122.5 188.5,119 202.5,119 206.5,115 R13.1
L+OUT
  Top 0.61: X2.2 202.11,21.41 K4.9
  Bottom 0.61: X3.1 126.62,16.95 127.78,15.79 175.5,15.79 | X2.2 200.4,15.79 175.5,15.79 | RCAL.1_+ 175.3,15.59 175.5,15.79
L-
  Top 0.61: K2.4 182.73,121.77 R15.1
L-OUT
  Top 0.61: X3.2 110.86,13.13 113,11 194,11 198,15 198,17.2 X2.3
  Bottom 0.61: K4.8 195.8,22.5 197,22.5 198.3,21.2 X2.3
LC
  Top 0.61: R26.1 114.5,42.5 108,49 106.5,49 104.69,47.19 U$12.P$23
LRCK
  Top 0.61: DSDR-.4 DSDR+.4 R-.4 R+.4 DSDL-.4 DSDL+.4 L-.4 L+.4
  Bottom 0.61: U$12.P$28 99.61,83.47 99.66,83.52 99.66,90.46 DSDL+.4
LRCKI
  Top 0.61: JP4.1 123,54 121.5,55.5 96,55.5 92,59.5 U$12.P$31
MCUGND
  pour Top (isolate 0.406): 0,162.5 36,162.5 36,90 0,90
  pour Bottom (isolate 0.406): 0,90 36,90 36,162 0,162
MCUV
  Bottom 1.016: X6.2 5.47,140.97 9,144.5 17.5,144.5 18.5,143.5 C45.+ C46.+ 27.36,141.5 PCB1.VIN
N$1
  Bottom 0.813: COAX.1_+ 61,16.5 63.5,19 65.17,19 T1.1
N$2
  Top 0.813: COAX.2_G 63.8,16.2 63,17 63,21.45 T1.3
N$3
  Bottom 0.813: BNC.1_+ 81,17 83,19 87.14,19 T2.1
N$4
  Top 0.813: BNC.2_G 83.8,20.28 T2.3
N$5
  Top 0.61: U$3.5 61.53,29.22 R1.2 61.5,27.31 61.5,24.5 55.77,18.77 T1.6
N$6
  Top 0.61: U$3.4 59.03,27.84 R1.1 58.53,27.14 T1.4
N$7
  Bottom 0.406: U$4.5 74.05,20.66 R2.2
  Bottom 0.61: T2.6 77.21,19.29 76.5,20 75.21,20 R2.2
N$8
  Bottom 0.406: U$4.4 74.17,22.56 R2.1
  Bottom 0.61: R2.1 76.41,23.05 T2.4
N$9  (via drill 3.2 pad 1.02)
  other vias: 79.9,98.1
N$10
  Top 0.813: R+.9 74.5,133 79.5,138 156,138 158,136 158,135 K1.11
N$11  (via drill 0.7)
  Top 0.813: K1.9 162.89,137.61 158,142.5 55,142.5 v54.5,142
  Bottom 0.813: v54.5,142 54.5,134.5 52.5,132.5 50.74,132.5 DSDR+.9
N$12
  Top 0.813: R-.9 62.5,131.51 61.24,130.24 61.24,121.58 61.98,120.84 62.16,120.84 64.5,118.5 140.5,118.5 148.5,126.5 148.5,128 150.5,130 156.5,130 157.5,129 157.5,127.5 K1.6 157.5,126.88
N$13
  Top 0.813: DSDR-.9 38.5,136 42,139.5 158,139.5 160,137.5 160,130.08 K1.8
N$14
  Bottom 0.813: K2.11 187.81,132.31 185,129.5 185,125 183,123 131.5,123 127.5,127 127.5,130 125,132.5 122.74,132.5 L+.9
N$15
  Bottom 0.813: K2.6 188,127 188,124 183,119 117.5,119 114,122.5 114,130.5 112.24,132.26 L-.9
N$16
  Bottom 0.813: DSDL-.9 82.76,132.26 81,130.5 81,120 83,118 117.06,118 117.08,117.98 185.48,117.98 193,125.5 193,127.08 K2.8
N$17
  Bottom 0.813: K2.9 189.94,134.81 188.01,136.74 137.56,136.74 135.63,134.81 99.81,134.81 98.5,133.5 DSDL+.9
N$18  (via drill 3.2 pad 1.02)
  other vias: 215.9,16.1
N$19  (via drill 3.2 pad 1.02)
  other vias: 215.9,156
N$21  (via drill 3.2 pad 1.02)
  other vias: 215.9,106.6
N$22  (via drill 3.2 pad 1.02)
  other vias: 3.9,16.1
N$23  (via drill 3.2 pad 1.02)
  other vias: 3.9,156
N$24  (via drill 3.2 pad 1.02)
  other vias: 3.9,106.6
N$25
  Bottom 0.61: C30.+ 72.5,37.5 73.5,38.5 73.5,38.93 QG1.14 75.74,37.45 C4.2 U$15.5
N$26  (via drill 0.7)
  Top 0.61: Q1.B 137,131.5 139,129.5 139,122 v140,121 | R3.2 123.5,64 126.5,64 132.5,70 132.5,113.5 136.5,117.5 143,117.5 145,119.5 v145,120.5
  Bottom 0.61: v140,121 144.5,121 v145,120.5
N$27
  Bottom 0.61: U$16.5 98.55,30.19 C7.2 98.55,28.24 QG2.14 96.19,23.31 96.5,23 C31.+
N$28  (via drill 0.7)
  Top 0.61: R4.2 126.19,63.19 126.84,63.19 133.31,69.66 133.31,113 136.81,116.5 143.5,116.5 145.44,118.44 147.5,120.5 v149,120.5 | v167.5,120.5 167.5,124.5 169.5,126.5 169.5,129.5 168.5,130.5 Q2.B
  Bottom 0.61: v149,120.5 v167.5,120.5
N$29
  Top 0.61: DSDL-.7 DSDL+.7 L-.7 L+.7
  Bottom 1.016: U$19.5 100.06,141.06 99,140 C132.+ 95,138.5 92.5,136 92.5,127.5 | C134.1 92.6,127.6 92.5,127.5 | 92.5,127.5 86.82,127.5 DSDL-.7 84.42,127.18 C133.1 | L-.7 107.92,127.18 C130.1 | L+.7 119.92,127.18 C131.1
N$30
  Top 0.61: R+.7 R-.7
  Bottom 0.254: 38.25,127.25 DSDR-.7
  Bottom 0.61: 48,127.18 DSDR+.7 R-.7 65.42,127.18 C104.1 | R+.7 77.08,127.18 C105.1 | DSDR-.7 41.5,127.18 C102.1 C103.1
  Bottom 0.813: C103.1 48,127.18
  Bottom 1.016: R-.7 60,129.68 C85.+ 61.56,139.56 U$18.5
N$31
  Top 0.61: R-.6 R+.6
  Bottom 0.254: 38.25,124.5 DSDR-.6 | C93.1 48,124.64 | C94.1 65.5,124.5 62.75,124.5 R-.6 | C97.1 77.5,124.75 75,124.75 R+.6
  Bottom 0.61: R-.6 DSDR+.6 48.5,124.64 | 48.5,124.64 48,124.64 | DSDR-.6 41.5,124.64 C87.1 48.5,124.4 48.5,124.64
  Bottom 1.016: R+.6 73,126.14 C86.+ 74.56,139.06 U$17.5
N$32
  Top 0.406: IC1.3 5.66,83.84 5.66,82.62 22.38,65.89 46.61,65.89 48.5,64 48.5,62.54 U$12.P$48
N$33
  Top 0.406: U$12.P$47 51.35,68.15 49.05,70.45 18.69,70.45 6.89,82.25 6.89,82.61 6.5,83 6.5,84.27 IC1.4
N$34  (via drill 0.7)
  Top 0.61: L+.6 L-.6 DSDL+.6 DSDL-.6
  Top 1.016: v125,136.5 125,127.14 L+.6
  Bottom 1.016: C99.1 86.26,124.4 DSDL-.6 | C100.1 98.26,124.4 DSDL+.6 | C95.1 109.76,123.9 L-.6 | C96.1 122.26,124.4 L+.6 | 111.5,138.5 C88.+ | 111.5,138.5 112.14,138.5 114.06,136.59 124.91,136.59 v125,136.5 | U$20.5 111.56,138.56 111.5,138.5
N$35
  Top 0.406: U$12.P$46 53.89,69.11 51.94,71.06 18.94,71.06 7.5,82.5 7.5,84.27 IC1.5
N$36
  Top 0.406: U$12.P$45 56.43,68.57 53.33,71.67 19.33,71.67 9,82 9,84.31 IC1.6
N$37
  Top 0.61: R7.2 R8.1 152.46,106.5 U$5.6
N$38
  Top 0.61: Q2.C 169,134.81 D2.C K2.16
N$39
  Top 0.406: U$12.P$44 58.97,70.03 56.72,72.28 27.22,72.28 16.5,83 16.5,84.31 IC2.3
N$40
  Top 0.406: U$12.P$43 61.51,69.99 58.61,72.89 27.61,72.89 18,82.5 18,84.27 IC2.4
N$41
  Bottom 0.61: K1.16 D1.C 140.73,134.04 Q1.C
N$42
  Top 0.406: U$12.P$42 64.05,71.45 62,73.5 28.21,73.5 19.89,81.82 19.89,82.61 19,83.5 19,84.27 IC2.5
N$43
  Top 0.406: U$12.P$41 66.59,69.91 62,74.5 28.07,74.5 23.34,79.23 23.34,79.66 20.5,82.5 20.5,84.31 IC2.6
N$44
  Top 0.406: U$12.P$40 69.13,68.58 62.5,75.21 35.57,75.21 29.28,81.5 29.28,81.72 28,83 28,84.31 IC3.3
N$45
  Top 0.406: U$12.P$39 71.67,66.97 62.82,75.82 35.82,75.82 29.89,81.75 29.89,83.11 29.5,83.5 29.5,84.27 IC3.4
N$46
  Top 0.406: U$12.P$38 74.21,65.29 63,76.5 36,76.5 30.5,82 30.5,84.27 IC3.5
N$47
  Top 0.61: U$5.7 152.46,103.5 R8.2 R18.1
N$48
  Top 0.61: U$5.2 160.58,104 R6.1 R5.2
N$49
  Top 0.61: R17.1 R6.2 160.5,101 U$5.1
N$50
  Top 0.61: C67.1 213.6,102.4 212,104 R11.2
  Bottom 0.61: R11.2 205.08,104 U$6.3
N$51
  Top 0.406: IC2.14 16.59,103.91 14.5,106 12.8,106 PCB1.D12
N$52
  Top 0.406: IC2.13 17.86,104.64 14.5,108 14.5,108.5 14,109 12.64,109 PCB1.D11
N$53
  Top 0.406: IC2.12 19.14,105.86 14,111 12.88,111 PCB1.D10
N$54
  Top 0.406: IC2.11 20.41,107.09 14,113.5 12.92,113.5 PCB1.D9
N$55
  Top 0.406: IC3.14 28.09,98.41 25.5,101 22.5,101 22,101.5 22,108 14,116 12.96,116 PCB1.D8
N$56
  Top 0.406: IC3.13 29.36,99.14 26.5,102 24.5,102 23.5,103 23.5,108.5 14.5,117.5 14,117.5 PCB1.D7
N$57
  Top 0.406: IC3.12 30.64,99.86 25,105.5 25,110 13.5,121.5 12.54,121.5 PCB1.D6
N$58
  Top 0.61: C65.1 168.6,104.4 R9.2
  Bottom 0.61: R9.2 161.58,105 U$5.3
N$59
  Top 0.61: C66.1 144.9,104.9 R10.2
  Bottom 0.61: R10.2 148.88,105 U$5.5
N$60
  Top 0.61: R10.3 145.92,107.54 148.54,110.16 160.87,110.16 162.92,108.11 164.51,108.11 165.08,107.54 R9.3 168,111.14 U$7.5 170.79,111.2 C70.+
N$61
  Top 0.61: C68.1 188.4,103.9 R12.2
  Bottom 0.61: U$6.5 194.31,108.31 190,104 R12.2
N$62
  Top 0.61: R12.3 191.19,109.23 191.19,109.81 191.49,110.11 203.42,110.11 204.66,108.87 204.66,108.72 205.49,107.89 209.15,107.89 R11.3 210.5,108 211.5,109 211.5,110.64 U$8.5 214.71,110.7 C69.+
N$63
  Top 0.61: U$6.2 203.58,103.5 R14.1 R13.2
N$64
  Top 0.61: R15.2 R16.1 195.46,106 U$6.6
N$65
  Top 0.61: R22.1 201,96.95 C17.1 R19.2
N$66
  Top 0.61: R20.1 193,99.5 192.5,100 R16.2 192.73,103.23 U$6.7
N$67
  Top 0.61: R19.1 R14.2 203.5,100.5 U$6.1
N$68
  Top 0.61: R21.1 198.55,95.05 C17.2 R20.2
N$69
  Top 0.61: 215.5,92.5 208,92.5 207.05,93.45 C18.1 R22.2 | 215.5,92.5 216,92.5 | 216,93.7 U$9.P$39 215.79,92 | 215.79,92 U$9.P$38 | 215.5,92.5 215.5,92.29 215.79,92
N$70
  Top 0.61: 182.77,92.5 U$9.P$2 | 182.77,92.5 U$9.P$3 | 182.77,92.5 191.5,92.5 192.45,93.45 C19.2 R21.2
N$71
  Top 0.61: R18.2 C14.2 155,97.95 155,96.5 154.5,96 R24.1
N$72
  Top 0.61: 139.27,92.5 U$11.P$3 | 139.27,92.5 U$11.P$2 | R24.2 C16.2 148.45,93.45 147.5,92.5 139.27,92.5
N$73
  Top 0.61: R23.1 157.5,97.45 C14.1 R17.2
N$74
  Top 0.61: 172.29,92.5 U$11.P$39 | 172.29,92.5 U$11.P$38 | 172.29,92.5 164.5,92.5 163.55,93.45 C15.1 R23.2
N$75
  Top 0.61: R25.2 152.73,46.5 Q3.B
N$76
  Top 0.61: R26.2 148.88,42.5 149.55,41.83 197.33,41.83 200,44.5 Q4.B
N$77
  Top 0.61: K4.16 203.31,43 D4.C 203.81,47 Q4.C
N$78
  Top 0.61: Q3.C 156.73,47.77 158.5,46 158.5,43.19 D3.C
  Bottom 0.61: K3.16 D3.C
N$79
  Top 0.61: U$13.2 160.08,83.5 160.5,83.5 162.9,85.9 C22.1 162.5,86.9 R28.2
N$80
  Top 0.61: U$13.6 150.23,85.77 149.5,86.5 148,86.5 | R30.2 149,87.5 148,86.5 | C23.1 147.9,86.4 148,86.5
N$81
  Top 0.61: R29.1 149,82.5 147.9,83.6 C23.2 147.87,83.23 U$13.7
N$82
  Top 0.61: 162,79.5 R27.1 | 162,79.5 161,79.5 U$13.1 | C22.2 163.5,83 162.5,82 162.5,80 162,79.5
N$83
  Top 0.61: U$14.2 159.81,58.81 163,62 163.4,62 C24.1 163,62.4 R32.2
N$84
  Top 0.61: R34.2 149,63.5 147.5,62 C25.1 147.63,61.27 U$14.6
N$85
  Top 0.61: 148,58.73 U$14.7 | 148,58.73 147.63,58.73 C25.2 | R33.1 149,57.73 148,58.73
N$86
  Top 0.406: U$2.1_VOUT 19,8 U1.2
N$87
  Top 0.61: C24.2 163.5,56 R31.1 162.5,55.5 161.5,56.5 160.12,56.5 U$14.1
N$88
  Top 0.61: U$21.2 203.73,83.73 206,86 206.9,86 C26.1 207,88.5 R36.2
N$89  (via drill 3.2 pad 1.02)
  other vias: 109.9,156
N$90
  Top 0.254: U$1.1_CABLE_PLUGGED 26.76,62.76 25.5,61.5 25.5,56.73 IC9.2
N$91  (via drill 0.7)
  Top 0.305: v23,98.5 23,96.5 23.5,96 24.95,96 C13.2 25,96 25.5,95.5
  Top 0.406: C11.2 2,96.12 2.62,96.12 2.62,93.6 IC1.16 2.56,91 v2.5,91 | 25.5,95.5 25.5,93.6 | C12.2 13.5,96.12 14.12,96.12 14.12,93.6 IC2.16 14,93.6 v14,91 | IC3.16 25.5,93.6 | 25.5,93.6 v25.5,91 | JP2.9 25.58,135.67 27,134.25 PCB1.5V
  Bottom 0.305: PCB1.5V 26.25,134.25 23,131 v23,98.5
  Bottom 0.406: v2.5,91 v14,91 v25.5,91
  Bottom 0.61: JP3.2 23.5,148 25.5,150 25.5,151.65 JP2.9
N$92
  Bottom 0.61: JP3.1 17,150 18,151 18,151.69 JP2.3
N$93
  Top 0.254: U$1.3_DATA/DSD1 21.68,62.82 23,61.5 23,59.5 24.5,58 24.5,56.73 IC9.3
N$94
  Top 0.254: IC10.2 17.64,57.2 18.47,58.03 19.03,58.03 20.5,59.5 20.5,62 20,62.5 19.54,62.5 U$1.4_CLD/DSDCLK
N$95
  Top 0.254: IC10.3 16.36,57.87 18,59.5 18,61.5 U$1.5_FSCLK/DSD2
N$97
  Top 0.254: IC11.3 7.87,57.87 9.32,59.32 9.41,59.32 10.02,59.93 10.02,61.4 U$1.7_DSDON
N$98
  Top 0.254: 19.12,55.88 19.45,55.55 C126.1 21.95,55.55 22.5,55 26.5,55 27,55.5 27,56 | 19.12,55.88 19,56 19,56.51 IC10.1 | 19.12,55.88 18.42,55.17 14.66,55.17 14.28,55.55 C125.1 11.46,55.55 IC11.1 10.5,56.5 10.5,55 6,55 5,56 5,61.5 4,62.5 U$1.10_3.3V | 27,56 27,56.51 IC9.1 | C127.1 27.45,55.55 27,56
  Bottom 0.254: C128.1 3.67,55.67 4,56 IC13.1 | IC13.1 4.09,55.41 4.5,55 9.95,55 C129.1 12.05,55.55 12.5,56 12.5,56.5 IC12.1 | U$1.9_3.3V U$1.10_3.3V 2.5,61.5 2.5,60 4,58.5 4,56.7 IC13.1
N$99
  Top 0.254: IC11.2 9.13,57.63 10,58.5 11.5,58.5 12,59 12.7,59 U$1.16_DSD64_128
N$100
  Bottom 0.254: U$1.17_F0 11.86,60.36 13,61.5 14.39,61.5 15.1,60.79 15.1,56.63 IC12.3
N$101
  Bottom 0.254: IC12.2 13.87,58.63 13,59.5 12.13,59.5 11.95,59.32 11.09,59.32 10.48,59.93 10.48,60.02 10,60.5 9.12,60.5 U$1.18_F1
N$102
  Bottom 0.254: IC13.3 6.63,60.16 U$1.19_F2
N$103
  Bottom 0.254: IC13.2 5.37,58.63 4.5,59.5 4.5,59.76 U$1.20_F3
N$104
  Top 0.61: R38.2 192.5,88.5 191,87 C27.1 191.37,86.27 U$21.6
N$105
  Top 0.61: 191.5,83.1 C27.2 | 191.5,83.1 194.56,83.1 U$21.7 | R37.1 192.5,81 191,82.5 191,83 190.5,83.5 191.1,83.5 191.5,83.1
N$106
  Top 0.61: C26.2 207,80.5 R35.1 204.5,79.5 U$21.1
N$107
  Top 0.61: 206,61.4 C28.1 | 206,61.4 205.48,61.4 U$22.2 | R40.2 205.5,61.9 206,61.4
N$108
  Top 0.61: R42.2 192.5,62.4 191.55,61.45 | 191.55,61.45 C29.1 | U$22.6 191.73,61.27 191.55,61.45
N$109
  Top 0.61: U$22.7 191.63,58.73 C29.2 191.4,58.1 192.5,57 R41.1
N$110
  Top 0.61: U$22.1 204.31,56.19 R39.1 206.5,56 C28.2
N$111
  Bottom 0.61: K4.4 195.42,32.5 192,32.5 189,35.5 189,47.5 185.77,50.73 U$9.P$19 U$9.P$18
N$112
  Top 0.61: 139.27,82 U$11.P$6 | 139.27,82 U$11.P$7 | R29.2 145.5,80 143,82.5 139.77,82.5 139.27,82
N$113
  Top 0.61: 139.27,57 U$11.P$16 | 139.27,57 U$11.P$17 | R33.2 145.5,55 143.5,57 139.27,57
N$114
  Top 0.61: 139.27,62 U$11.P$14 | 139.27,62 U$11.P$15 | R34.1 146,63.5 144.5,62 139.27,62
N$115
  Top 0.61: 139.27,87.5 U$11.P$4 | 139.27,87.5 U$11.P$5 | R30.1 145,89.5 143,87.5 139.27,87.5
N$116
  Top 0.61: 172.29,83 U$11.P$35 | 172.29,83 U$11.P$34 | R27.2 166,79.5 169,82.5 171.79,82.5 172.29,83
N$117
  Top 0.61: 172.29,87.5 U$11.P$37 | 172.29,87.5 U$11.P$36 | R28.1 168,89.5 170,87.5 172.29,87.5
N$118
  Top 0.61: 172.29,57 U$11.P$25 | 172.29,57 U$11.P$24 | R31.2 167,55.5 168.5,57 172.29,57
N$119
  Top 0.61: 172.29,62 U$11.P$27 | 172.29,62 U$11.P$26 | R32.1 166,64.5 168.5,62 172.29,62
N$120
  Top 0.61: R41.2 188,55 186,57 182.77,57 | 182.77,57 U$9.P$16 | 182.77,57 U$9.P$17
N$121
  Top 0.61: 182.77,62 U$9.P$15 | 182.77,62 U$9.P$14 | R42.1 187,62 182.77,62
N$122
  Top 0.61: 182.77,82.5 U$9.P$6 | 182.77,82.5 U$9.P$7 | R37.2 187,82.5 182.77,82.5
N$123
  Top 0.61: 182.77,87.5 U$9.P$4 | 182.77,87.5 U$9.P$5 | R38.1 189.5,89 188,87.5 182.77,87.5
N$124
  Top 0.61: 215.79,82.5 U$9.P$34 | 215.79,82.5 U$9.P$35 | R35.2 210,79.5 213,82.5 215.79,82.5
N$125
  Top 0.61: 215.79,87.5 U$9.P$37 | 215.79,87.5 U$9.P$36 | R36.1 210,89.5 212,87.5 215.79,87.5
N$126
  Top 0.61: 215.79,62 U$9.P$27 | 215.79,62 U$9.P$26 | R40.1 209.5,64.5 212,62 215.79,62
N$127
  Top 0.61: 215.79,57 U$9.P$25 | 215.79,57 U$9.P$24 | R39.2 210.5,55 212.5,57 215.79,57
N$128
  Bottom 0.61: K4.13 206.27,32.77 211,37.5 211,48 214,51 215.52,51 U$9.P$22 U$9.P$23
N$130
  Top 0.61: U$11.P$18 U$11.P$19
  Bottom 0.61: U$11.P$19 142.27,50.73 143.5,49.5 143.5,35.5 147,32 150.46,32 K3.4
N$131
  Top 0.61: U$11.P$23 U$11.P$22
  Bottom 0.61: K3.13 165.77,31.77 168,34 168,48 170.5,50.5 172.06,50.5 U$11.P$22
R+
  Top 0.61: K1.13 154.19,134.81 158.5,130.5 158.5,129.5 160,128 160,120 163.5,116.5 R5.1
R+OUT
  Top 0.61: K3.9 158.31,21.31 155.75,18.75 | 155.75,18.75 155.5,18.5 137.11,18.5 X1.2 133.61,15 103.5,15 101.64,13.13 X3.3 | RCAR.1_+ 155.7,18.7 155.75,18.75
R-
  Top 0.61: K1.4 152.73,119.23 149.5,116 R7.1
R-OUT
  Top 0.61: K3.8 134.61,21.61 | 134.61,21.61 132.5,19.5 132.5,17.7 X1.3 | 134.61,21.61 107.11,21.61 104.5,19 102.24,19 X3.4
RBCLK
  Top 0.254: JP1.5 41.63,23.14 64,45.5 64,46.94 U$12.P$7
RC
  Top 0.61: R25.1 113,46.5 109,50.5 104,50.5 102,48.5 102,47.14 U$12.P$22
RDATA
  Top 0.254: JP1.1 36.55,23.55 58.5,45.5 58.5,46.52 U$12.P$5
RDSDON
  Top 0.254: JP1.7 44.17,23.18 66.5,45.5 66.5,46.9 U$12.P$8
RLRCK
  Top 0.254: JP1.3 39.09,23.59 61.5,46 U$12.P$6
SCK
  Top 0.406: JP2.5 20.5,130 24,126.5 27.6,126.5 PCB1.A5
SISO
  Top 0.406: PCB1.A3 28.05,121.55 31.5,125 31.5,145 30,146.5 30,155 27.5,157.5 22,157.5 20.5,156 JP2.6
STB
  Top 0.406: JP2.8 23.04,155.54 24,156.5 26.5,156.5 28.5,154.5 28.5,145.5 30,144 30,125 29,124 27.82,124 PCB1.A4
TOSLINK
  Top 0.406: U1.4 19.94,33.94 30.5,44.5 55,44.5 56.5,46 56.5,46.92 U$12.P$4
UCLK
  Top 0.406: IC10.7 17.64,49.87 19.5,48 46.5,48 47.5,49 50.5,49 51,48.5 51,47.34 U$12.P$2
UDATA
  Top 0.406: IC9.6 24.36,50.13 25,49.5 46,49.5 46.5,50 53,50 54,49 54,47.1 U$12.P$3
UDSDON  (via drill 0.7)
  Top 0.406: IC11.6 7.87,47.63 10.25,45.25 10.5,45 v11,44.5
  Bottom 0.406: v11,44.5 42.5,44.5 47,49 71.16,49 72.73,47.43 72.73,46.77 74.5,45 79,45 79.5,45.5 79.5,46.78 U$12.P$13
UGND
  Top 0.254: IC10.4 14.24,57.45 C125.2 13,57.5
  Bottom 0.254: C129.2 8.76,57.45 IC13.4
  pour Bottom: 0.5,65 28.5,65 28.5,59 18.5,59 18.5,54.5 0.5,54.5
  pour Top (isolate 0.406): 2,65 30.5,65 30.5,54.5 2,54.5
ULRCK
  Top 0.406: IC10.6 16.36,49.13 19,46.5 48.32,46.5 U$12.P$1

## Text on the board
tNames: DSDR- | DSDR+ | R- | R+ | DSDL- | L- | L+ | DSDL+